# EAGLE design ac-adapter (EAGLE 9.6.2)
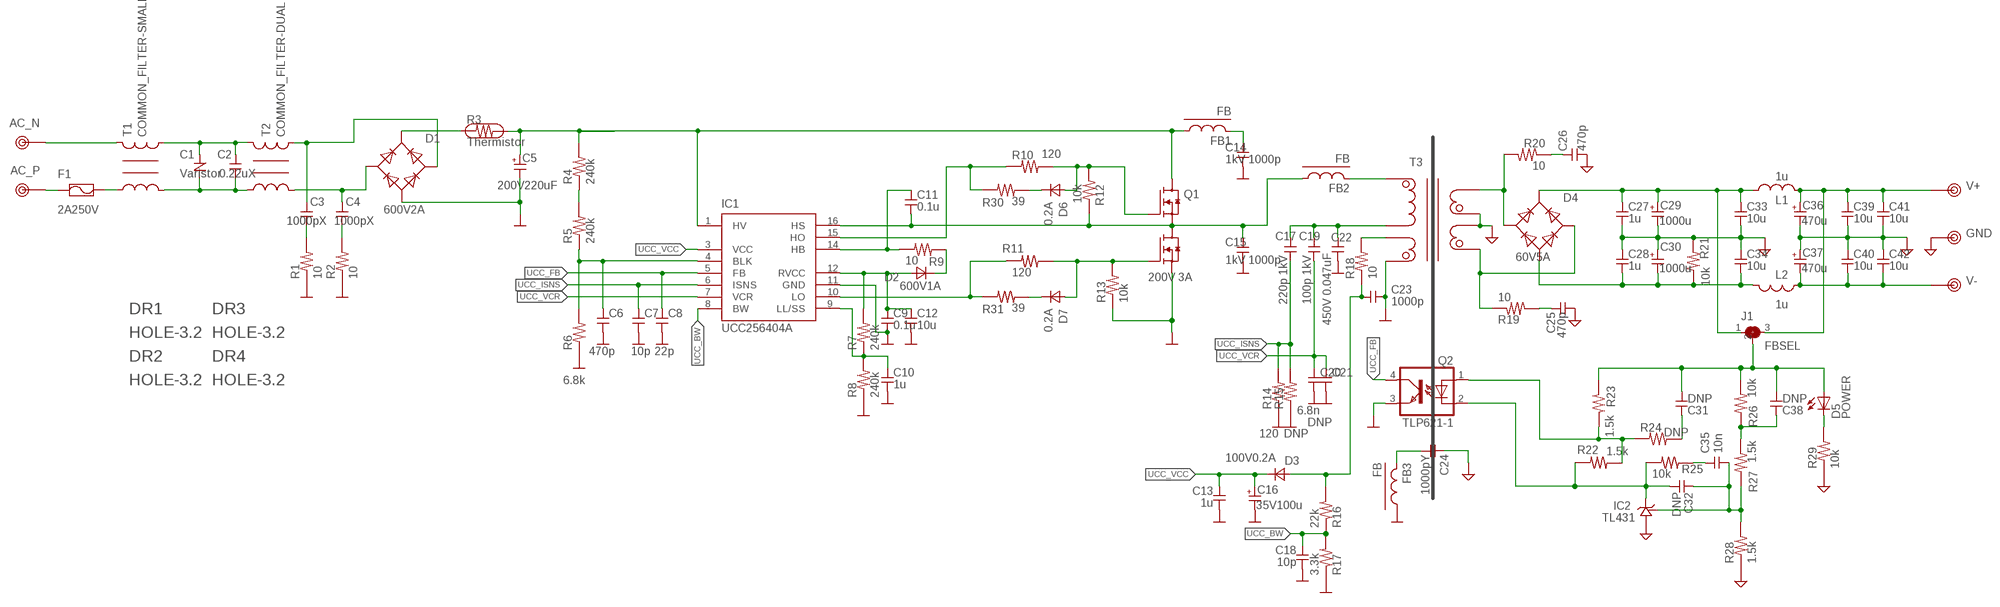
[diagram p0: schematic, sheet 1]

## Parts
C1  Varistor  VARISTOR  [V050]
C2  0.22uX  C-X  [X-CAPACITER]
C3  1000pX  C-3216  [3216]
C4  1000pX  C-3216  [3216]
C5  200V220uF  CPOLE7.5-16A3  [E5-16A3]
C6  470p  C-1608  [1608]
C7  10p  C-1608  [1608]
C8  22p  C-1608  [1608]
C9  0.1u  C-1608  [1608]
C10  1u  C-1608  [1608]
C11  0.1u  C-1608  [1608]
C12  10u  C-2012  [2012]
C13  1u  C-1608  [1608]
C14  1kV 1000p  C-3225  [3225]
C15  1kV 1000p  C-3225  [3225]
C16  35V100u  CPOLE2.5-8  [E2,5-8]
C17  220p 1kV  C-3225  [3225]
C18  10p  C-1608  [1608]
C19  100p 1kV  C-3225  [3225]
C20  6.8n  C-1608  [1608]
C21  DNP  C-1608  [1608]
C22  450V 0.047uF  C-12.5  [C125]
C23  1000p  C-1608  [1608]
C24  1000pY  C-Y  [Y-CAPACITER]
C25  470p  C-1608  [1608]
C26  470p  C-1608  [1608]
C27  1u  C-2012-2  [2012-2]
C28  1u  C-2012-2  [2012-2]
C29  1000u  CPOLE5-13  [E5-13]
C30  1000u  CPOLE5-13  [E5-13]
C31  DNP  C-1608  [1608]
C32  DNP  C-1608  [1608]
C33  10u  C-3225-3  [3225-3]
C34  10u  C-3225-3  [3225-3]
C35  10n  C-1608  [1608]
C36  470u  CPOLE5-10  [E5-10]
C37  470u  CPOLE5-10  [E5-10]
C38  DNP  C-1608  [1608]
C39  10u  C-3225-3  [3225-3]
C40  10u  C-3225-3  [3225-3]
C41  10u  C-4532-2  [4532-2]
C42  10u  C-4532-2  [4532-2]
D1  600V2A  DIODE4-GBU8A  [GBU8A]
D2  600V1A  DIODE-1N4148W  [SOD123]
D3  100V0.2A  DIODE-1N4148W  [SOD123]
D4  60V5A  DIODE4-RBA406B  [RBA-406]
D5  POWER  LED-SMD1608  [D1608]
D6  0.2A  DIODE-1N4148W  [SOD123]
D7  0.2A  DIODE-1N4148W  [SOD123]
DR1  HOLE-3.2  [HOLE_3.2]
DR2  HOLE-3.2  [HOLE_3.2]
DR3  HOLE-3.2  [HOLE_3.2]
DR4  HOLE-3.2  [HOLE_3.2]
F1  2A250V  FUSE-5  [FUSE-5]
FB1  FB  FB2012-FB  [2012-FB]
FB2  FB  FB-3216  [3216-J]
FB3  FB  FB2012-FB  [2012-FB]
IC1  UCC256404A  UCC25640X  [SO16-LACK3-13]
IC2  TL431  [TO-92]
J1  FBSEL  SJ-3-2012  [2012-3-J]
L1  1u  L-5  [L5-7,5]
L2  1u  L-5  [L5-7,5]
Q1  200V 3A  NMOS_FET_HALF  [NMOS-FET_HALF]
Q2  TLP621-1  [DIL04]
R1  10  R-2012  [2012]
R2  10  R-2012  [2012]
R3  Thermistor  THERMISTOR  [THERMISTOR090]
R4  240k  R-1608  [1608]
R5  240k  R-1608  [1608]
R6  6.8k  R-1608  [1608]
R7  240k  R-1608  [1608]
R8  240k  R-1608  [1608]
R9  10  R-1608  [1608]
R10  120  R-1608  [1608]
R11  120  R-1608  [1608]
R12  10k  R-1608  [1608]
R13  10k  R-1608  [1608]
R14  120  R-1608  [1608]
R15  DNP  R-1608  [1608]
R16  22k  R-1608  [1608]
R17  3.3k  R-1608  [1608]
R18  10  R-2012  [2012]
R19  10  R-2012  [2012]
R20  10  R-2012  [2012]
R21  10k  R-1608  [1608]
R22  1.5k  R-1608  [1608]
R23  1.5k  R-1608  [1608]
R24  DNP  R-1608  [1608]
R25  10k  R-1608  [1608]
R26  10k  R-1608  [1608]
R27  1.5k  R-1608  [1608]
R28  1.5k  R-1608  [1608]
R29  10k  R-1608  [1608]
R30  39  R-1608  [1608]
R31  39  R-1608  [1608]
T1  COMMON_FILTER-SMALL  [COMMON_FILTER__SMALL]
T2  COMMON_FILTER-DUAL  [SU10VFC-DUAL]
T3  TRANSFORMAER_FLYBACK-ETD34  [BETD34LLC]
TP1  AC_N  TESTPIN-LARGE  [TESTPIN-LARGE]
TP2  AC_P  TESTPIN-LARGE  [TESTPIN-LARGE]
TP3  V+  TESTPIN-LARGE  [TESTPIN-LARGE]
TP4  V-  TESTPIN-LARGE  [TESTPIN-LARGE]
TP5  GND  TESTPIN-LARGE  [TESTPIN-LARGE]

## Nets
GND: C24.1 C25.2 C26.2 C27.2 C28.1 C29.- C30.+ C33.2 C34.1 C36.- C37.+ C39.2 C40.1 C41.2 C42.1 IC2.2(GND) R21.1 R28.1 R29.1 T3.8(L3_P) T3.11(L4_N) TP5.1
N$1: T1.4 TP1.1
N$2: D6.1(A) Q1.GT R10.2 R12.1
N$3: C26.1 R20.1
N$4: C3.1 D1.3(AC2) T2.2 T2.6
N$5: C4.1 D1.2(AC1) T2.3
N$6: C38.1 R26.1 R27.2
N$7: D7.2(K) R31.2
N$8: C17.1 C19.1 C22.1 T3.3(L1_N)
N$9: D7.1(A) Q1.GB R11.1 R13.2
N$10: C25.1 R19.2
N$11: C3.2 R1.2
N$12: IC1.10(LO) R11.2 R31.1
N$13: C14.1 FB1.2
N$14: C11.1 IC1.14(HB) R9.1
N$15: D2.2(K) R9.2
N$16: C9.1 C12.1 D2.1(A) IC1.12(RVCC) R7.2
N$17: C10.1 IC1.9(LL/SS) R7.1 R8.2
N$18: C6.1 IC1.4(BLK) R5.1 R6.2
N$19: C1.1 C2.1 T1.3 T2.1 T2.5
N$20: IC1.15(HO) R10.1 R30.1
N$21: R4.1 R5.2
N$22: R18.2 T3.6(L2_N)
N$23: C31.1 R24.2
N$24: C23.1 D3.1(A) R16.2 R18.1
N$25: D1.1(V+) R3.1
N$26: F1.2 T1.1
N$27: FB2.2 T3.1(L1_P)
N$28: C1.2 C2.2 T1.2 T2.4
N$29: C32.2 IC2.3(OUT) Q2.2(C) R22.2 R25.1
N$30: F1.1 TP2.1
N$31: C24.2 FB3.2
N$32: C32.1 C35.2 IC2.1(REF) R27.1 R28.2
N$33: C35.1 R25.2
N$34: Q2.1(A) R22.1 R23.2 R24.1
N$35: D4.2(AC1) R20.2 T3.9(L3_N)
N$36: D4.3(AC2) R19.1 T3.10(L4_P)
N$37: D5.K R29.2
N$38: C4.2 R2.2
N$39: D6.2(K) R30.2
PGND: C5.- C6.2 C7.2 C8.2 C9.2 C10.2 C12.2 C13.2 C14.2 C15.2 C16.- C18.2 C20.2 C21.2 C22.2 C23.2 D1.4(V-) FB3.1 IC1.11(GND) Q1.V- Q2.3(EMIT) R1.1 R2.1 R6.1 R8.1 R13.1 R14.1 R15.1 R17.1 T3.5(L2_P)
SW: C11.2 C15.1 FB2.1 IC1.16(HS) Q1.SW R12.2
UCC_BW: C18.1 IC1.8(BW) R16.1 R17.2
UCC_FB: C8.1 IC1.5(FB) Q2.4(COL)
UCC_ISNS: C7.1 C17.2 IC1.6(ISNS) R14.2 R15.2
UCC_VCC: C13.1 C16.+ D3.2(K) IC1.3(VCC)
UCC_VCR: C19.2 C20.1 C21.1 IC1.7(VCR)
V+: C27.1 C29.+ C33.1 D4.1(V+) J1.1 L1.2
V+FB: C31.2 C38.2 D5.A J1.2 R23.1 R26.2
V+FIL: C36.+ C39.1 C41.1 J1.3 L1.1 TP3.1
V-: C28.2 C30.- C34.2 D4.4(V-) L2.2 R21.2
V-FIL: C37.- C40.2 C42.2 L2.1 TP4.1
VH: C5.+ FB1.1 IC1.1(HV) Q1.V+ R3.2 R4.2

## Library data of the parts
C1 = my_rcl:VARISTOR
C2-C4 C6-C15 C17-C28 C31-C35 C38-C42 = my_rcl:C
C5 C16 C29 C30 C36 C37 = my_rcl:CPOL
D1 D4 = my_rcl:DIODE4
D2 D3 D6 D7 = my_rcl:DIODE
D5 = my_rcl:LED
DR1-DR4 = my_connector:HOLE-3.2
F1 = my_rcl:FUSE
FB1-FB3 = my_rcl:FB
IC1 = my_ic:UCC25640X
IC2 = my_ic:TL431
J1 = my_rcl:SJ-3
L1 L2 = my_rcl:L
Q1 = my_ic:NMOS_FET_HALF
Q2 = my_ic:TLP621-1: Photocoupler
R1 R2 R4-R31 = my_rcl:R
R3 = my_rcl:THERMISTOR
T1 T2 = my_rcl:COMMON_FILTER
T3 = my_rcl:TRANSFORMAER_FLYBACK
TP1-TP5 = my_connector:TESTPIN

## Board
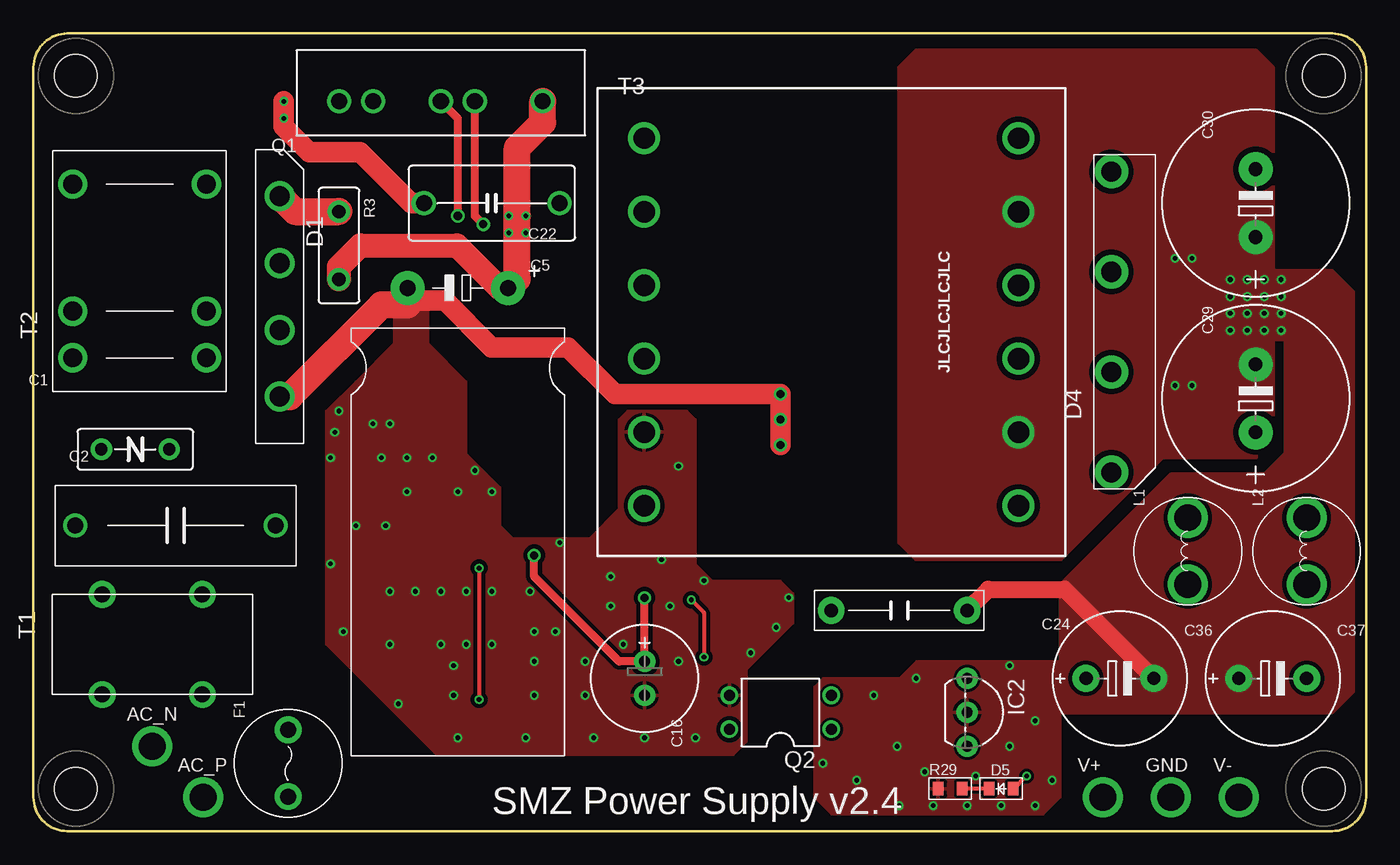
[diagram p1: board, top side]
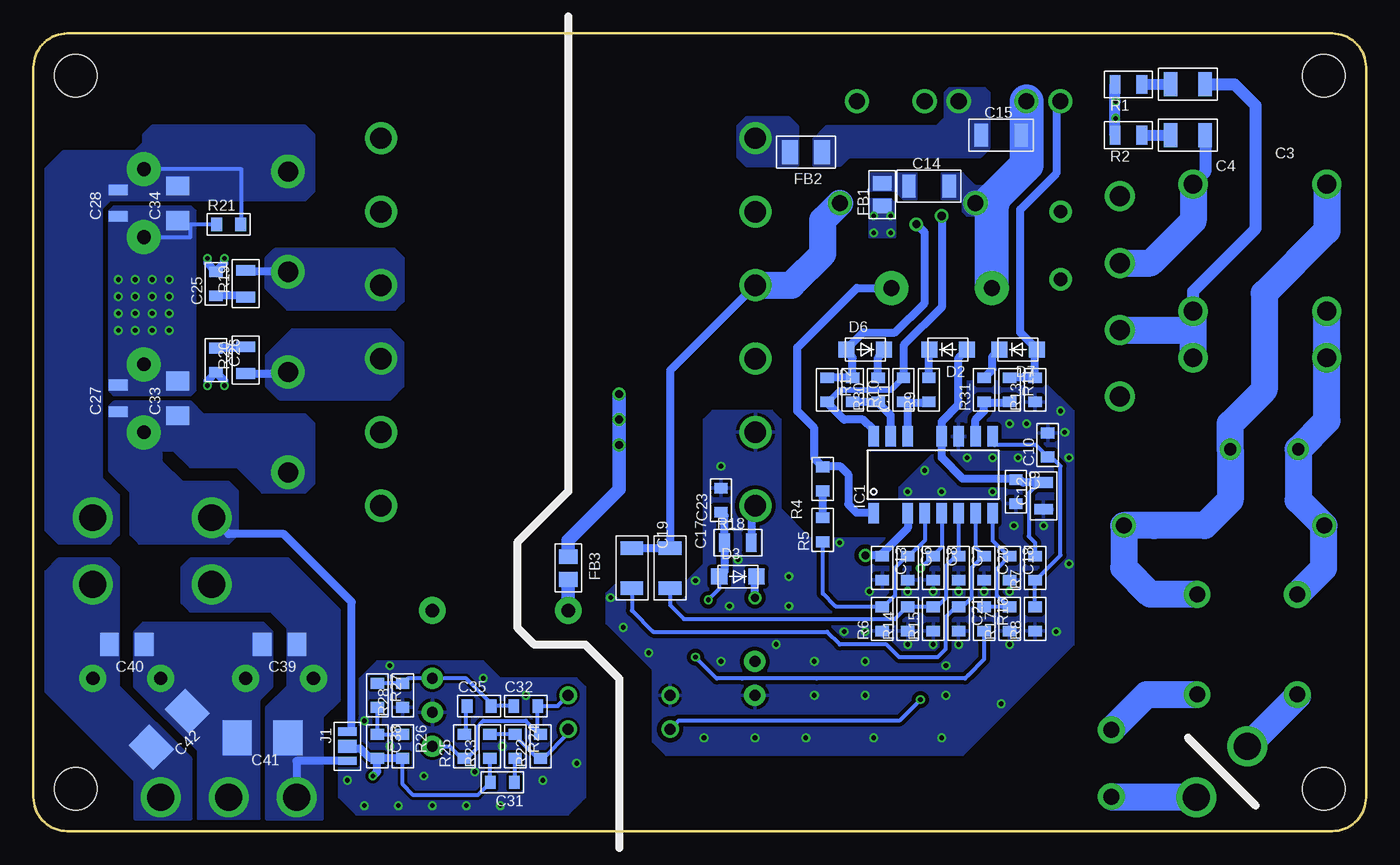
[diagram p2: board, bottom side, seen from below]

Size 99.69 x 59.69 mm. Coordinates in mm from the lower left corner, seen from the top.
Outline: 0,57.15 0,2.54 arc90 2.54,0 97.16,0 arc90 99.69,2.54 99.69,57.15 arc90 97.16,59.69 2.54,59.69 arc90 0,57.15
Copper layers (1*16): Top 0.035mm / dielectric 1.5mm / Bottom 0.035mm
Design rules "SeeedStudio_2layer_DRU_20140221 *": minimum track width 6mil, minimum drill 0.3mm, track to track 8mil, track to pad 8mil, pad to pad 8mil, via to via 12mil, smd to smd 0mil, copper to edge 0.3mm, drill to drill 10mil, minimum pad ring 0.25mm, minimum via ring 6mil, stop-mask expansion 2mil, vias tented up to drill 1mm, thermal gap 10mil

### Footprints (pad centres in the part's own frame; a part is rotated, then mirrored left to right if it is on the bottom)
V050 = drill 0.9 pad 1.6: 1 -2.54,0; 2 2.54,0
X-CAPACITER = drill 1.2: 1 -7.5,0; 2 7.5,0
3216 = smd 1 x 1.8: 1 -1.3,0; 2 1.3,0
E5-16A3 = drill 1.2 pad 2.54: + 3.75,0; - -3.75,0
1608 = smd 0.8 x 1: 1 -0.9,0; 2 0.9,0
2012 = smd 0.8 x 1.4: 1 -1,0; 2 1,0
3225 = smd 1 x 1.7: 1 -1.5,0; 2 1.5,0
E2,5-8 = drill 0.813 pad 1.6: + -1.27,0; - 1.27,0
C125 = drill 1.2: 1 -5.08,0; 2 5.08,0
Y-CAPACITER = drill 1 pad 2: 1 -5.08,0; 2 5.08,0
2012-2 = smd 0.8 x 1.4: 1 -1,0; 2 1,0
E5-13 = drill 1.016 pad 2.54: + -2.54,0; - 2.54,0
3225-3 = smd 1.4 x 1.7: 1 -1.3,0; 2 1.3,0
E5-10 = drill 1 pad 2: + -2.54,0; - 2.54,0
4532-2 = smd 2.2 x 2.6: 1 -1.9,0; 2 1.9,0
GBU8A = drill 1.5: 1 -7.5,0; 2 -2.5,0; 3 2.5,0; 4 7.5,0
SOD123 = smd 1.2 x 1.2: 1 -1.4,0; 2 1.4,0
RBA-406 = drill 1.5 pad 2.5: 1 -11.25,0; 2 -3.75,0; 3 3.75,0; 4 11.25,0
D1608 = smd 0.8 x 1: A 0.9,0; K -0.9,0
HOLE_3.2 = hole 3.2: 0,0
FUSE-5 = drill 1.2 pad 2: 1 -2.5,0; 2 2.5,0
2012-FB = smd 1.1 x 1.4: 1 -0.85,0; 2 0.85,0
3216-J = smd 1.2 x 1.8: 1 -1.2,0; 2 1.2,0
SO16-LACK3-13 = smd 0.762 x 1.524: 1 -4.445,-2.875; 3 -1.905,-2.875; 4 -0.635,-2.875; 5 0.635,-2.875; 6 1.905,-2.875; 7 3.175,-2.875; 8 4.445,-2.875; 9 4.445,2.875; 10 3.175,2.875; 11 1.905,2.875; 12 0.635,2.875; 14 -1.905,2.875; 15 -3.175,2.875; 16 -4.445,2.875
TO-92 = drill 0.813 pad 1.6: 1 -2.54,0; 2 0,0; 3 2.54,0
2012-3-J = smd 0.6 x 1.4: 1 -1.1,0; 3 1.1,0 | smd 1 x 1.4: 2 0,0
L5-7,5 = drill 2 pad 3: 1 -2.5,0; 2 2.5,0
NMOS-FET_HALF = drill 1.2 pad 1.8: GB -7.62,0; GT 2.54,0; SW 0,0; V+ 7.62,0; V- -5.08,0
DIL04 = drill 0.813: 1 -1.27,-3.81; 2 1.27,-3.81; 3 1.27,3.81; 4 -1.27,3.81
THERMISTOR090 = drill 1 pad 1.676: 1 -2.54,0; 2 2.54,0
COMMON_FILTER__SMALL = drill 1.2 pad 2: 1 -3.75,3.75; 2 -3.75,-3.75; 3 3.75,-3.75; 4 3.75,3.75
SU10VFC-DUAL = drill 1.4 pad 2.2: 1 -6.5,5; 2 -6.5,-5; 3 6.5,-5; 4 6.5,5; 5 -3,5; 6 -3,-5
BETD34LLC = drill 1.6: 1 -14,13.75; 2 -14,8.25; 3 -14,2.75; 4 -14,-2.75; 5 -14,-8.25; 6 -14,-13.75; 7 14,-13.75; 8 14,-8.25; 9 14,-2.75; 10 14,2.75; 11 14,8.25; 12 14,13.75
TESTPIN-LARGE = drill 2: 1 0,0

### Placement (x,y rotation side)
C1  7.62,28.57 0 top
C2  10.64,22.86 0 top
C3  13.34,55.88 180 bottom
C4  13.34,52.07 180 bottom
C5  31.75,40.64 0 top
C6  34.29,19.68 270 bottom
C7  30.48,19.68 270 bottom
C8  32.38,19.68 270 bottom
C9  26.19,25.4 270 bottom
C10  23.81,28.89 90 bottom
C11  34.61,33.02 90 bottom
C12  24.13,25.08 270 bottom
C13  36.2,19.68 270 bottom
C14  32.7,48.26 0 bottom
C15  27.3,52.07 0 bottom
C16  45.72,11.43 270 top
C17  52.07,19.68 270 bottom
C18  26.67,19.68 270 bottom
C19  54.93,19.68 270 bottom
C20  28.57,19.68 270 bottom
C21  30.48,15.88 270 bottom
C22  34.29,46.99 180 top
C23  48.26,24.77 90 bottom
C24  64.77,16.51 180 top
C25  86.04,40.96 90 bottom
C26  86.04,35.24 270 bottom
C27  93.34,32.38 90 bottom
C28  93.34,46.99 90 bottom
C29  91.44,32.38 90 top
C30  91.44,46.99 90 top
C31  64.61,3.65 180 bottom
C32  62.87,9.37 0 bottom
C33  88.9,32.38 90 bottom
C34  88.9,46.99 90 bottom
C35  66.36,9.37 0 bottom
C36  81.28,11.43 0 top
C37  92.71,11.43 0 top
C38  73.98,6.35 270 bottom
C39  81.28,13.97 180 bottom
C40  92.71,13.97 180 bottom
C41  82.55,6.99 180 bottom
C42  89.53,7.62 225 bottom
D1  18.41,40.01 270 top
D2  31.27,36.04 180 bottom
D3  46.99,19.05 0 bottom
D4  80.64,38.1 90 top
D5  72.39,3.17 0 top
D6  37.47,36.04 0 bottom
D7  26.04,36.04 180 bottom
DR1  3.17,56.52 0 top
DR2  96.52,3.17 0 top
DR3  3.17,3.17 0 top
DR4  96.52,56.52 0 top
F1  19.05,5.08 90 top
FB1  36.2,47.62 90 bottom
FB2  41.91,50.8 180 bottom
FB3  59.69,19.68 270 bottom
IC1  32.38,26.67 0 bottom
IC2  69.85,8.89 270 top
J1  76.2,6.35 270 bottom
L1  86.36,20.95 90 top
L2  95.25,20.95 90 top
Q1  30.48,54.61 0 top
Q2  55.88,8.89 90 top
R1  17.78,55.88 0 bottom
R2  17.78,52.07 0 bottom
R3  22.86,43.81 270 top
R4  40.64,26.35 90 bottom
R5  40.64,22.54 90 bottom
R6  36.2,15.88 90 bottom
R7  24.77,19.68 90 bottom
R8  24.77,15.88 90 bottom
R9  32.7,33.02 90 bottom
R10  38.42,33.02 90 bottom
R11  26.67,33.02 270 bottom
R12  40.32,33.02 270 bottom
R13  24.77,33.02 90 bottom
R14  34.29,15.88 90 bottom
R15  32.38,15.88 90 bottom
R16  28.57,15.88 270 bottom
R17  26.67,15.88 90 bottom
R18  46.99,21.59 0 bottom
R19  83.82,40.96 270 bottom
R20  83.82,35.24 270 bottom
R21  85.09,45.4 0 bottom
R22  61.75,6.35 90 bottom
R23  65.56,6.35 90 bottom
R24  63.66,6.35 270 bottom
R25  67.47,6.35 90 bottom
R26  72.07,6.35 270 bottom
R27  73.98,10.16 270 bottom
R28  72.07,10.16 90 bottom
R29  68.58,3.17 0 top
R30  36.51,33.02 90 bottom
R31  28.57,33.02 90 bottom
T1  8.89,13.97 180 top
T2  7.94,41.91 90 top
T3  59.69,38.1 0 top
TP1  8.89,6.35 0 top
TP2  12.7,2.54 0 top
TP3  80.01,2.54 0 top
TP4  90.17,2.54 0 top
TP5  85.09,2.54 0 top

### Tracks (layer width: path | path; a pad name or v marks a point on that pad's centre or on a via)
GND  (via drill 0.35)
  Top 1.27: C24.1 71.44,18.1 77.15,18.1 C36.-
  Bottom 0.305: C30.+ 87.95,44.45 87.95,45.4 R21.1
  Bottom 0.61: v85.41,42.86 85.41,42.49 C25.2 86.68,42.49 v86.68,42.86 | v85.41,33.34 85.41,33.71 C26.2 86.68,33.71 v86.68,33.34
  other vias: 93.34,41.27 92.08,41.27 90.81,41.27 89.53,41.27 89.53,40.01 90.81,40.01 92.08,40.01 93.34,40.01 93.34,38.73 92.08,38.73 90.81,38.73 89.53,38.73 89.53,37.47 90.81,37.47 92.08,37.47 93.34,37.47 76.2,3.81 74.93,1.91 72.39,1.91 69.85,1.91 67.31,1.91 64.77,1.91 61.59,3.81 73.03,12.38 66.04,11.43 66.67,4.45 70.48,4.13 64.61,6.35 62.87,10.16 73.03,6.35 74.93,8.26 59.05,5.08
  pour Bottom (isolate 0.305, no thermals): 93.98,46.35 93.98,33.02 93.66,32.7 87.95,32.7 87.63,33.02 87.63,46.35 87.95,46.67 93.66,46.67
  pour Bottom (isolate 0.305, no thermals): 82.87,0.95 87.31,0.95 87.31,6.03 92.08,10.79 92.08,14.92 91.44,15.56 82.55,15.56 81.92,14.92 81.92,10.79 82.87,9.84
  pour Top (isolate 0.305, no thermals): 98.74,40.32 97.16,41.91 93.66,41.91 93.66,28.26 92.08,26.67 85.09,26.67 76.83,18.41 76.83,8.89 97.16,8.89 98.74,10.48
  pour Top (isolate 0.305, no thermals): 98.74,40.32 97.16,41.91 88.9,41.91 88.9,36.83 98.74,36.83
  pour Top (isolate 0.406, no thermals): 64.77,57.15 66.04,58.42 91.44,58.42 92.71,57.15 92.71,29.21 91.44,27.94 84.45,27.94 76.83,20.32 66.04,20.32 64.77,21.59
  pour Bottom: 59.69,1.27 58.42,2.54 58.42,10.79 59.05,11.43 64.77,11.43 66.04,12.7 73.98,12.7 75.25,11.43 75.25,8.57 76.83,6.99 76.83,2.54 75.56,1.27
  pour Top: 59.69,1.27 58.42,2.54 58.42,10.79 59.05,11.43 64.77,11.43 66.04,12.7 76.83,12.7 76.83,2.54 75.56,1.27
N$1
  Bottom 2.032: TP1.1 5.14,10.1 T1.4
N$2  (via drill 0.6)
  Top 0.61: Q1.GT 33.02,46.04 v33.66,45.4
  Bottom 0.61: v33.66,45.4 33.02,44.77 33.02,39.53 35.24,37.31 37.62,37.31 38.87,36.06 D6.1 38.87,35.88 38.42,35.43 38.42,33.97 | R10.2 38.42,33.97 | R12.1 40.27,33.97 38.42,33.97
N$3
  Bottom 0.61: R20.1 83.92,36.14 C26.1
N$4
  Bottom 0.914: C3.1 9.84,55.88 8.26,54.29 8.26,45.09 12.94,40.4 T2.6
  Bottom 2.032: T2.2 T2.6 12.94,37.51 D1.3
N$5
  Bottom 0.914: C4.1 12.04,49.31 T2.3
  Bottom 2.032: D1.2 16.11,42.51 12.94,45.68 T2.3
N$6
  Bottom 0.305: R27.2 C38.1 R26.1
N$7
  Bottom 0.61: R31.2 27.94,34.55 27.94,35.53 D7.2
N$8
  Bottom 0.61: T3.3 52.07,34.47 C17.1 C19.1
  Bottom 2.032: C22.1 40.64,45.72 40.64,43.18 42.97,40.85 T3.3
N$9
  Bottom 0.61: Q1.GB 23.18,54.29 23.18,49.21 25.88,46.51 25.88,37.31 24.64,36.06 D7.1 24.77,35.91 R13.2 24.82,33.97 26.62,33.97 R11.1
N$10
  Bottom 0.61: R19.2 83.92,40.06 C25.1
N$11
  Bottom 0.813: R1.2 C3.2
N$12
  Bottom 0.61: IC1.10 29.21,30.8 28.57,31.43 R31.1 28.52,32.07 26.72,32.07 R11.2
N$13
  pour Bottom (no thermals): 37.15,47.94 35.24,47.94 34.61,47.31 33.66,47.31 33.66,49.21 37.15,49.21
N$14
  Bottom 0.61: R9.1 32.76,32.07 34.29,32.07 | 34.29,32.07 34.55,32.07 C11.1 | IC1.14 34.29,32.07
N$15
  Bottom 0.61: D2.2 32.7,36.01 R9.2
N$16
  Bottom 0.305: R7.2 24.77,21.59 25.24,22.07 25.24,25.29 24.45,26.08 C12.1
  Bottom 0.61: D2.1 30.48,35.43 30.48,31.91 31.75,30.64 IC1.12 31.75,27.94 30.16,26.35 26.25,26.35 C9.1 25.88,26.3 25.66,26.08 C12.1
N$17
  Bottom 0.305: IC1.9 27.94,29.05 27.78,28.89 24.71,28.89 C10.1 23.55,27.99 22.86,27.3 22.86,20.64 24.71,18.79 R7.1 R8.2
N$18
  Bottom 0.305: IC1.4 33.02,21.75 34.18,20.59 C6.1 34.34,20.59 35.24,19.68 35.24,17.62 36.09,16.77 R6.2 36.25,16.83 39.69,16.83 40.64,17.78 R5.1
N$19
  Bottom 2.032: C2.1 3.17,22.86 | T1.3 3.17,19.68 3.17,22.86 | 3.17,22.86 5.08,24.77 C1.1 2.94,30.72 T2.1 T2.5
N$20
  Bottom 0.61: IC1.15 35.56,31.11 36.51,32.07 R30.1 R10.1
N$21
  Bottom 0.61: R5.2 R4.1
N$22
  Bottom 0.61: T3.6 45.99,24.05 R18.2
N$23
  Bottom 0.305: R24.2 63.71,5.4 C31.1
N$24  (via drill 0.35)
  Top 0.305: v49.21,17.3 50.16,16.35 v50.16,13.02
  Bottom 0.305: R16.2 28.57,12.86 29.77,11.67 30,11.43 41.12,11.43 46.67,11.43 48.58,11.43 v50.16,13.02 | D3.1 48.39,18.13 v49.21,17.3
  Bottom 0.61: D3.1 47.99,19.45 R18.1 47.99,23.59 C23.1
N$25
  Top 2.032: D1.1 19.57,46.35 R3.1
N$26
  Bottom 2.032: F1.2 16.41,10.22 T1.1
N$27
  pour Bottom (no thermals): 46.35,49.85 42.55,49.85 42.55,52.7 43.18,53.34 46.35,53.34 46.99,52.7 46.99,50.48
N$28
  Bottom 2.032: T1.2 16.13,17.72 18.14,19.72 C2.2 15.88,22.86 12.06,22.86 10.16,24.77 C1.2 10.16,30.48 7.62,33.02 7.62,40.23 2.94,44.92 T2.4
N$29
  Bottom 0.305: IC2.3 68.58,6.35 67.68,5.45 R25.1 67.26,5.45 66.52,6.19 66.52,7.78 66.04,8.26 62.87,8.26 61.86,7.25 R22.2 61.97,7.46 C32.2 60.48,9.37 Q2.2
N$30
  Bottom 2.032: TP2.1 19.01,2.54 F1.1
N$31
  Bottom 1.016: FB3.2 C24.2
N$32
  Bottom 0.305: C32.1 C35.2 65.46,9.58 67.31,11.43 IC2.1 71.7,11.43 R28.2 R27.1
N$33
  Bottom 0.305: R25.2 67.31,7.41 67.31,9.31 C35.1
N$34
  Bottom 0.305: R23.2 R24.1 63.66,7.14 61.97,5.45 R22.1 61.54,5.45 59.69,7.3 Q2.1
N$35
  Bottom 0.61: R20.2 80.75,34.24 D4.2
  pour Bottom (isolate 0.305, no thermals): 73.03,37.47 80.33,37.47 82.23,35.56 82.23,33.34 81.28,32.38 73.03,32.38 72.07,33.34 72.07,36.51
N$36
  Bottom 0.61: R19.1 83.77,41.91 80.7,41.91 D4.3
  pour Bottom (isolate 0.305, no thermals): 81.6,43.5 72.71,43.5 72.07,42.86 72.07,39.69 72.71,39.05 80.64,39.05 82.23,40.64 82.23,42.86
N$37
  Top 0.305: D5.K R29.2
N$38
  Bottom 0.813: R2.2 C4.2
N$39
  Bottom 0.61: D6.2 36.06,35.88 36.51,35.43 R30.2
PGND  (via drill 0.35, 0.6)
  Top 1.524: C22.2 28.26,46.99 24.45,50.8 20.64,50.8 18.73,52.7 v18.73,53.34 v18.73,54.61 | 28,39.69 30.8,39.69 34.29,36.2 40.01,36.2 43.5,32.7 v55.88,32.7 v55.88,28.89
  Top 2.032: C5.- 28,39.69 28,39.37 26.04,39.37 19.17,32.51 D1.4
  Bottom 0.61: C15.2 25.4,52.07 | v18.73,54.61 18.78,54.61
  Bottom 0.813: R2.1 18.78,54.61 R1.1
  Bottom 1.016: FB3.1 59.69,21.75 55.88,25.57 v55.88,28.89 v55.88,30.8 v55.88,32.7
  Bottom 1.905: C22.2 28.26,46.99 27.94,46.99
  Bottom 2.54: Q1.V- 25.4,52.07 25.4,49.85 28.26,46.99 | C5.- 28,46.93 27.94,46.99
  other vias: 28.57,17.94 30.48,17.94 34.29,17.94 37.15,17.94 32.38,17.94 26.67,17.94 26.67,13.97 30.48,13.97 37.47,14.92 39.05,14.92 22.54,29.84 29.84,27.94 27.94,27.94 33.02,26.99 39.37,21.59 26.35,22.86 27.94,25.4 34.29,25.4 24.13,22.86 22.23,20 27.3,9.53 31.43,10.16 37.47,10.16 41.27,12.7 48.26,12.7 53.66,13.34 49.53,6.99 55.56,15.24 50.16,18.73 48.26,27.3 47.62,16.83 43.18,19.05 46.99,20.32 32.38,13.97 34.29,13.97 23.18,14.92 43.18,16.83 37.47,12.7 26.67,30.48 25.4,30.48 31.75,25.4 26.04,27.94 56.52,17.46 45.72,6.99 41.91,6.99 36.83,6.99 31.75,6.99 44.13,13.97 41.27,10.16 22.23,27.94 31.43,12.38 22.86,31.43
  pour Top (isolate 0.305, no thermals): 24.13,33.66 32.38,33.66 29.53,36.51 29.53,40.01 26.99,40.01 26.99,36.51
  pour Bottom (isolate 0.305): 55.88,18.73 50.8,18.73 49.53,20 49.53,30.8 48.9,31.43 44.45,31.43 43.81,30.8 43.81,24.13 41.59,21.91 35.88,21.91 34.92,22.86 34.92,25.72 32.38,28.26 32.38,30.48 31.11,31.75 31.11,33.02 30.48,33.66 24.13,33.66 21.91,31.43 21.91,13.97 30.16,5.71 52.39,5.71 53.34,6.67 53.34,12.06 56.83,15.56 56.83,17.78
  pour Top (isolate 0.305): 52.39,5.71 53.34,6.67 53.34,12.06 56.83,15.56 56.83,17.78 55.88,18.73 50.8,18.73 49.53,20 49.53,30.8 48.9,31.43 44.45,31.43 43.81,30.8 43.81,24.13 41.59,21.91 35.88,21.91 34.92,22.86 34.92,25.72 32.38,28.26 32.38,33.66 24.13,33.66 21.91,31.43 21.91,13.97 30.16,5.71
  pour Bottom (no thermals): 27.94,46.04 29.84,46.04 30.16,46.35 30.16,46.99 30.48,47.31 31.75,47.31 31.75,49.21 30.16,49.21 29.21,48.26 27.94,48.26
SW  (via drill 0.6)
  Top 0.61: v31.75,46.04 31.75,53.34 Q1.SW
  Bottom 0.406: 34.66,33.92 C11.2 34.66,33.92 | R12.2 40.27,32.12 39.37,33.02 35.56,33.02 34.66,33.92
  Bottom 0.61: C11.2 34.61,36.35 31.75,39.21 v31.75,46.04 | 40.27,32.12 40.27,32.02 39.05,30.8 37.62,30.8 36.83,30 IC1.16
  pour Bottom (no thermals): 31.11,55.56 28.57,55.56 28.26,55.24 28.26,51.12 28.89,50.48 38.73,50.48 39.37,49.85 41.27,49.85 41.27,51.75 40.32,52.7 32.07,52.7 31.43,53.34 31.43,55.24
UCC_BW
  Bottom 0.305: IC1.8 27.94,21.75 26.78,20.59 C18.1 27.62,19.63 27.62,17.62 26.78,16.77 R17.2 R16.1
UCC_FB  (via drill 0.35)
  Top 0.305: v33.34,19.68 v33.34,9.84
  Bottom 0.305: IC1.5 31.75,21.27 32.38,20.64 C8.1 33.28,19.68 v33.34,19.68 | Q2.4 51.44,8.26 34.92,8.26 v33.34,9.84
UCC_ISNS
  Bottom 0.305: IC1.6 C7.1 30.69,20.59 31.43,19.84 31.43,17.46 32.12,16.77 R15.2 R14.2 34.34,16.77 35.24,15.88 51.03,15.88 52.07,16.91 C17.2
UCC_VCC  (via drill 0.6)
  Top 0.61: v37.47,20.64 37.47,19.05 43.81,12.7 C16.+ v45.72,17.46
  Bottom 0.61: v45.72,17.46 45.72,18.92 D3.2 | IC1.3 34.29,22.7 36.2,20.8 C13.1 36.25,20.64 v37.47,20.64
UCC_VCR
  Bottom 0.305: C19.2 54.93,16.51 53.34,14.92 40.32,14.92 39.37,13.97 35.88,13.97 34.92,13.02 32.07,13.02 31.43,13.65 31.43,16.03 30.69,16.77 C21.1 30.21,16.77 29.53,17.46 29.53,19.68 28.63,20.59 C20.1 29.21,21.22 IC1.7
V+
  Bottom 0.61: J1.1 75.88,7.45 75.88,17.14 80.96,22.23 85.09,22.23 86.32,23.45 L1.2
  pour Bottom (isolate 0.305, no thermals): 79.38,25.4 78.74,26.04 78.74,30.48 79.38,31.11 87,31.11 87.95,32.07 93.66,32.07 93.98,31.75 93.98,26.99 92.39,25.4 92.39,22.23 91.76,21.59 85.09,21.59 84.45,22.23 84.45,25.4 85.09,26.04 88.58,26.04 90.17,27.62 90.17,28.57 89.22,28.57 87.95,27.3 84.45,27.3 82.55,25.4
V+FB  (via drill 0.35)
  Top 0.305: D5.A 73.34,3.17 v74.3,4.13
  Bottom 0.305: R26.2 72.07,3.49 71.28,2.7 66.52,2.7 66.46,2.7 C31.2 65.56,3.7 R23.1
  Bottom 0.61: R26.2 C38.2 | v74.3,4.13 73.98,4.45 C38.2 | C38.2 74.51,5.45 75.25,6.19 76.04,6.19 J1.2
V+FIL
  Bottom 0.61: J1.3 80.01,5.25 TP3.1
  pour Bottom (isolate 0.305, no thermals): 82.23,0.95 78.11,0.95 78.11,8.57 76.83,9.84 76.83,16.51 80.64,20.32 87.95,20.32 88.58,19.68 88.58,17.14 87.95,16.51 81.92,16.51 80.64,15.24 80.64,10.79 82.23,9.21
V-
  Bottom 0.305: C30.- 84.14,49.53 84.14,45.45 R21.2
  pour Bottom (isolate 0.305, no thermals): 93.98,47.31 79.38,47.31 78.74,47.94 78.74,52.07 79.38,52.7 90.81,52.7 91.44,52.07 91.44,51.44 92.08,50.8 97.47,50.8 98.74,49.53 98.74,22.54 97.79,21.59 93.98,21.59 93.34,22.23 93.34,25.08 94.61,26.35 94.61,46.67
V-FIL
  pour Bottom (isolate 0.305, no thermals): 92.08,0.95 87.95,0.95 87.95,5.4 93.34,10.79 93.34,19.68 93.98,20.32 97.79,20.32 98.74,19.37 98.74,10.48 92.08,3.81
VH  (via drill 0.35)
  Top 0.305: v36.83,46.04 36.2,46.04
  Top 1.778: C5.+ 34.87,40.64 31.69,43.81 24.45,43.81 22.86,42.23 R3.2
  Top 2.032: Q1.V+ 38.1,53.02 36.2,51.12 36.2,46.04 36.2,41.34 C5.+
  Bottom 0.61: IC1.1 36.85,23.81 38.1,23.81 38.73,24.45 38.73,26.67 39.37,27.3 40.59,27.3 R4.2 41.27,27.89 41.27,30.16 42.55,31.43 42.55,36.2 38.1,40.64 C5.+
  other vias: 35.56,46.04 35.56,44.77 36.83,44.77
  pour Bottom (no thermals): 35.56,47.31 37.15,47.31 37.15,44.45 35.24,44.45 35.24,46.99

### Text on the board
tPlace: JLCJLCJLCJLC | SMZ Power Supply v2.4